# Altium schematic sheet AMS1117.schdoc
size 59 x 33 mm
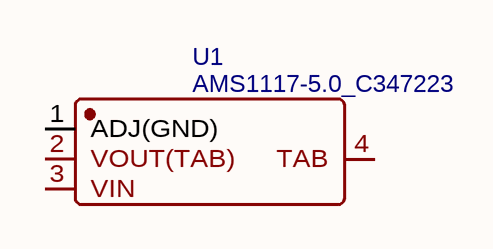
[diagram p0: AMS1117.schdoc]

## Parts
U1  AMS1117-5.0_C347223  [SOT-223_L6.7-W3.5-P2.30-BR]

## Nets

Not connected (* = marked no-connect by the designer): U1 1(ADJ(GND)) 2(VOUT(TAB)) 3(VIN) 4(TAB)

## Library data of the parts
U1 = AMS1117-5.0_C347223: BOM_Manufacturer: Youtai Semiconductor Co., Ltd.; Contributor: LCSC; BOM_Supplier: LCSC; BOM_Supplier Part: C347223; BOM_Manufacturer Part: AMS1117-5.0; BOM_JLCPCB Part Class: Extended Part; spicePre: U; spiceSymbolName: AMS1117-5.0_C347223